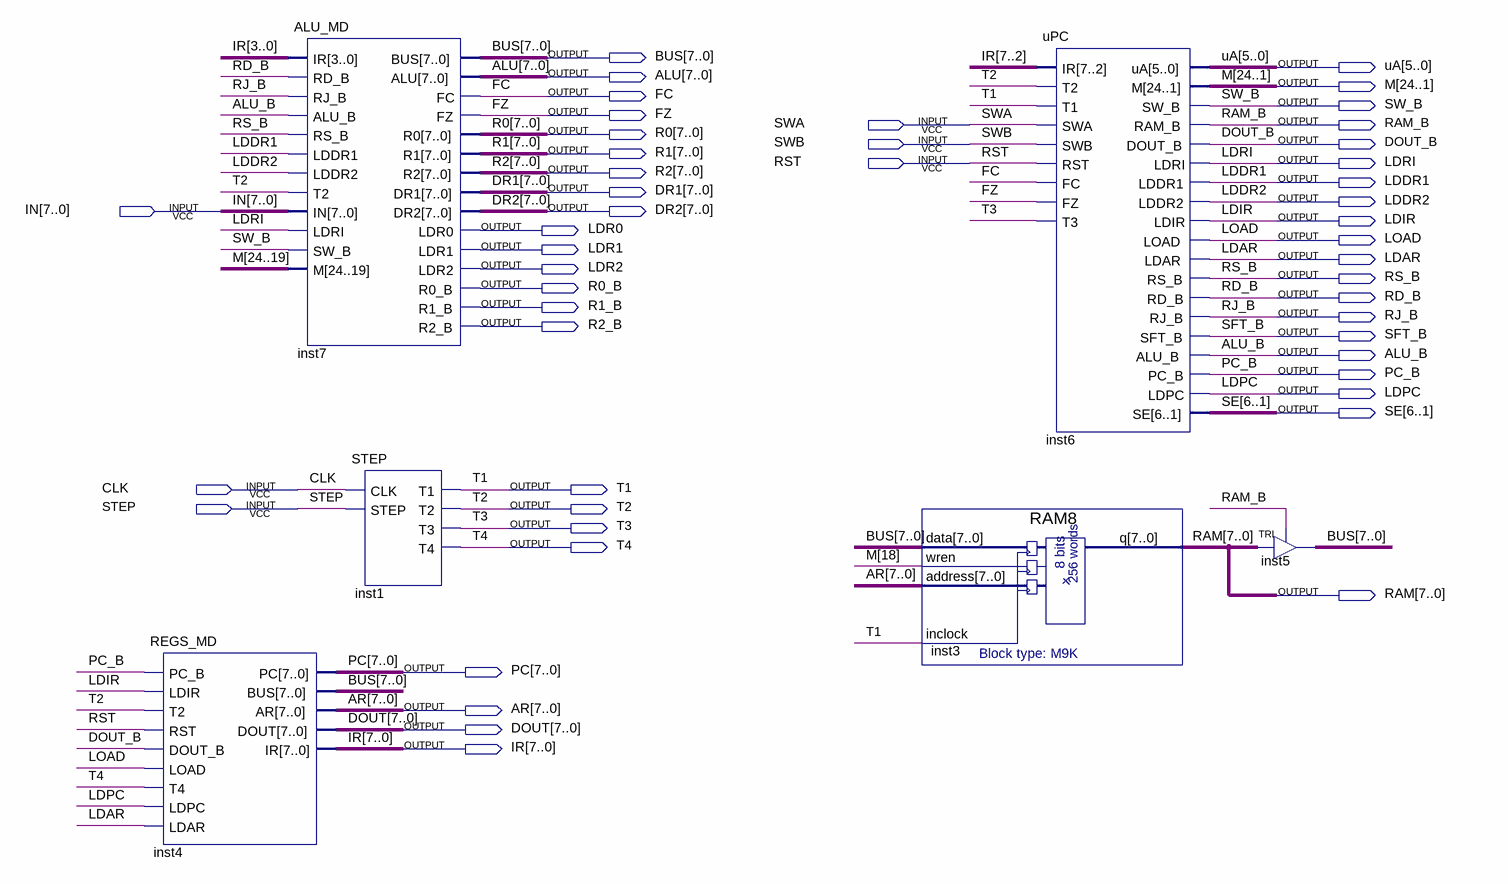
[diagram p0: schematic sheet]
// Quartus schematic cpu_8bit.bdf as structural Verilog: 6 symbols, 49 pins
module cpu_8bit (
  input  SWA,
  input  SWB,
  input  RST,
  input  [7:0] IN,
  input  CLK,
  input  STEP,
  output [7:0] BUS,
  output [5:0] uA,
  output [7:0] ALU,
  output [24:1] M,
  output FC,
  output SW_B,
  output FZ,
  output RAM_B,
  output [7:0] R0,
  output DOUT_B,
  output [7:0] R1,
  output LDRI,
  output [7:0] R2,
  output LDDR1,
  output [7:0] DR1,
  output LDDR2,
  output [7:0] DR2,
  output LDIR,
  output LDR0,
  output LOAD,
  output LDR1,
  output LDAR,
  output LDR2,
  output RS_B,
  output R0_B,
  output RD_B,
  output R1_B,
  output RJ_B,
  output R2_B,
  output SFT_B,
  output ALU_B,
  output PC_B,
  output LDPC,
  output [6:1] SE,
  output T1,
  output T2,
  output T3,
  output T4,
  output [7:0] RAM,
  output [7:0] PC,
  output [7:0] AR,
  output [7:0] DOUT,
  output [7:0] IR
);

  REGS_MD inst4 (
    .PC_B(PC_B), .LDIR(LDIR), .T2(T2), .RST(RST), .DOUT_B(DOUT_B), .LOAD(LOAD), .T4(T4), .LDPC(LDPC),
    .LDAR(LDAR), .PC(PC), .AR(AR), .DOUT(DOUT), .IR(IR), .BUS(BUS));
  ALU_MD inst7 (
    .IR(IR[3:0]), .RD_B(RD_B), .RJ_B(RJ_B), .ALU_B(ALU_B), .RS_B(RS_B), .LDDR1(LDDR1), .LDDR2(LDDR2),
    .T2(T2), .IN(IN), .LDRI(LDRI), .SW_B(SW_B), .M(M[24:19]), .ALU(ALU), .FC(FC), .FZ(FZ), .R0(R0), .R1(R1),
    .R2(R2), .DR1(DR1), .DR2(DR2), .LDR0(LDR0), .LDR1(LDR1), .LDR2(LDR2), .R0_B(R0_B), .R1_B(R1_B),
    .R2_B(R2_B), .BUS(BUS));
  STEP inst1 (.CLK(CLK), .STEP(STEP), .T1(T1), .T2(T2), .T3(T3), .T4(T4));
  RAM8 inst3 (.data(BUS), .wren(M[18]), .address(AR), .inclock(T1), .q(RAM));
  uPC inst6 (
    .IR(IR[7:2]), .T2(T2), .T1(T1), .SWA(SWA), .SWB(SWB), .RST(RST), .FC(FC), .FZ(FZ), .T3(T3), .uA(uA),
    .M(M), .SW_B(SW_B), .RAM_B(RAM_B), .DOUT_B(DOUT_B), .LDRI(LDRI), .LDDR1(LDDR1), .LDDR2(LDDR2),
    .LDIR(LDIR), .LOAD(LOAD), .LDAR(LDAR), .RS_B(RS_B), .RD_B(RD_B), .RJ_B(RJ_B), .SFT_B(SFT_B),
    .ALU_B(ALU_B), .PC_B(PC_B), .LDPC(LDPC), .SE(SE));
  TRI inst5[7:0] (.IN(RAM), .OE(RAM_B), .OUT(BUS));
endmodule
